# EAGLE design kitting_board (EAGLE 8.2.1)
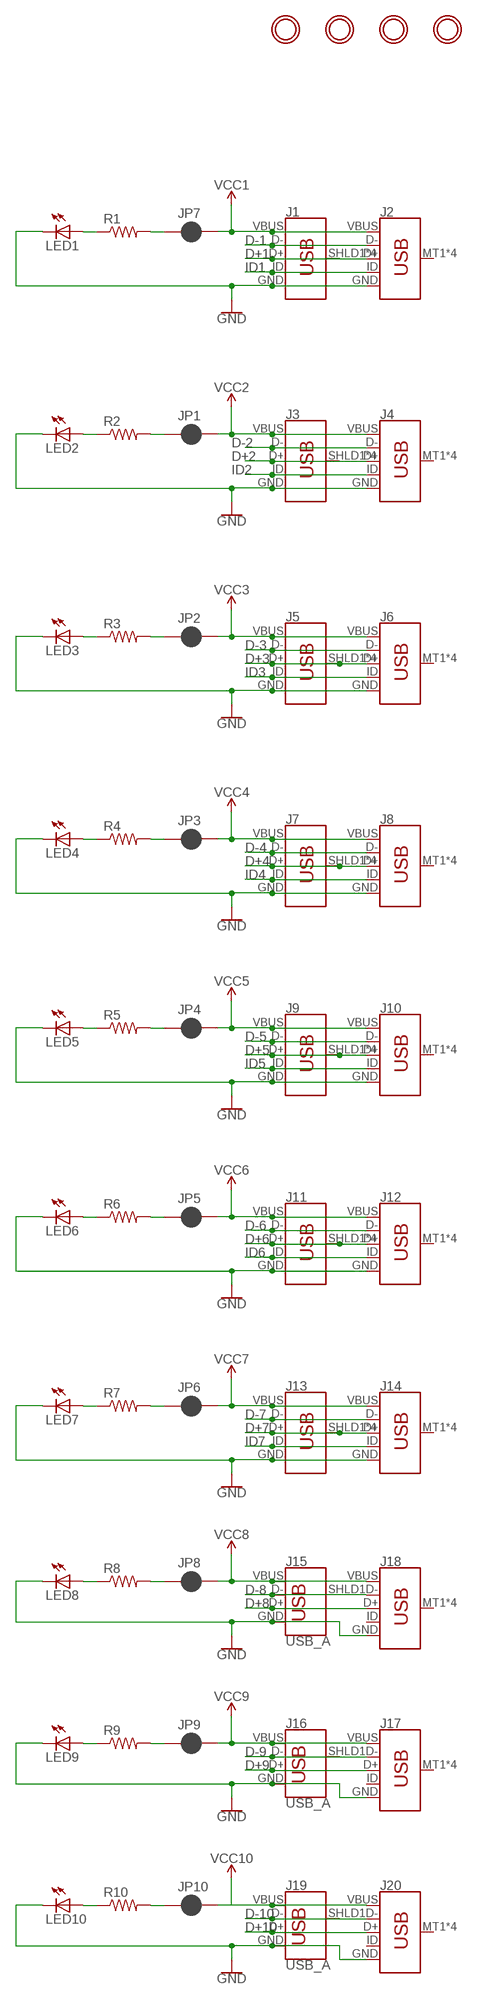
[diagram p0: schematic, sheet 1]

## Parts
J1  USB_MICRO-B_MALE-VERT  [USB_MICROB_VERTICAL]
J2  USB_MICRO-B_SMT  [USB-MICROB]
J3  USB_MICRO-B_MALE-VERT  [USB_MICROB_VERTICAL]
J4  USB_MICRO-B_SMT  [USB-MICROB]
J5  USB_MICRO-B_MALE-VERT  [USB_MICROB_VERTICAL]
J6  USB_MICRO-B_SMT  [USB-MICROB]
J7  USB_MICRO-B_MALE-VERT  [USB_MICROB_VERTICAL]
J8  USB_MICRO-B_SMT  [USB-MICROB]
J9  USB_MICRO-B_MALE-VERT  [USB_MICROB_VERTICAL]
J10  USB_MICRO-B_SMT  [USB-MICROB]
J11  USB_MICRO-B_MALE-VERT  [USB_MICROB_VERTICAL]
J12  USB_MICRO-B_SMT  [USB-MICROB]
J13  USB_MICRO-B_MALE-VERT  [USB_MICROB_VERTICAL]
J14  USB_MICRO-B_SMT  [USB-MICROB]
J15  USB_A  [USB-A-H-FEMALE-VRT-PTH]
J16  USB_A  [USB-A-H-FEMALE-VRT-PTH]
J17  USB_MICRO-B_SMT  [USB-MICROB]
J18  USB_MICRO-B_SMT  [USB-MICROB]
J19  USB_A  [USB-A-H-FEMALE-VRT-PTH]
J20  USB_MICRO-B_SMT  [USB-MICROB]
JP1  JUMPER-SMT_2_NC_PASTE_SILK  [SMT-JUMPER_2_NC_PASTE_SILK]
JP2  JUMPER-SMT_2_NC_PASTE_SILK  [SMT-JUMPER_2_NC_PASTE_SILK]
JP3  JUMPER-SMT_2_NC_PASTE_SILK  [SMT-JUMPER_2_NC_PASTE_SILK]
JP4  JUMPER-SMT_2_NC_PASTE_SILK  [SMT-JUMPER_2_NC_PASTE_SILK]
JP5  JUMPER-SMT_2_NC_PASTE_SILK  [SMT-JUMPER_2_NC_PASTE_SILK]
JP6  JUMPER-SMT_2_NC_PASTE_SILK  [SMT-JUMPER_2_NC_PASTE_SILK]
JP7  JUMPER-SMT_2_NC_PASTE_SILK  [SMT-JUMPER_2_NC_PASTE_SILK]
JP8  JUMPER-SMT_2_NC_PASTE_SILK  [SMT-JUMPER_2_NC_PASTE_SILK]
JP9  JUMPER-SMT_2_NC_PASTE_SILK  [SMT-JUMPER_2_NC_PASTE_SILK]
JP10  JUMPER-SMT_2_NC_PASTE_SILK  [SMT-JUMPER_2_NC_PASTE_SILK]
LED1  LEDCHIPLED_0805  [CHIPLED_0805]
LED2  LEDCHIPLED_0805  [CHIPLED_0805]
LED3  LEDCHIPLED_0805  [CHIPLED_0805]
LED4  LEDCHIPLED_0805  [CHIPLED_0805]
LED5  LEDCHIPLED_0805  [CHIPLED_0805]
LED6  LEDCHIPLED_0805  [CHIPLED_0805]
LED7  LEDCHIPLED_0805  [CHIPLED_0805]
LED8  LEDCHIPLED_0805  [CHIPLED_0805]
LED9  LEDCHIPLED_0805  [CHIPLED_0805]
LED10  LEDCHIPLED_0805  [CHIPLED_0805]
R1  R-US_R0805  [R0805]
R2  R-US_R0805  [R0805]
R3  R-US_R0805  [R0805]
R4  R-US_R0805  [R0805]
R5  R-US_R0805  [R0805]
R6  R-US_R0805  [R0805]
R7  R-US_R0805  [R0805]
R8  R-US_R0805  [R0805]
R9  R-US_R0805  [R0805]
R10  R-US_R0805  [R0805]
U$1  MOUNTINGHOLE3.0THIN  [MOUNTINGHOLE_3.0_PLATEDTHIN]
U$2  MOUNTINGHOLE3.0THIN  [MOUNTINGHOLE_3.0_PLATEDTHIN]
U$3  MOUNTINGHOLE3.0THIN  [MOUNTINGHOLE_3.0_PLATEDTHIN]
U$4  MOUNTINGHOLE3.0THIN  [MOUNTINGHOLE_3.0_PLATEDTHIN]

## Nets
D+1: J1.D+ J2.D+
D+2: J3.D+ J4.D+
D+3: J5.D+ J5.SHLD1(SHIELD) J5.SHLD2(SHIELD) J5.SHLD3(SHIELD) J5.SHLD4(SHIELD) J6.D+
D+4: J7.D+ J7.SHLD1(SHIELD) J7.SHLD2(SHIELD) J7.SHLD3(SHIELD) J7.SHLD4(SHIELD) J8.D+
D+5: J9.D+ J9.SHLD1(SHIELD) J9.SHLD2(SHIELD) J9.SHLD3(SHIELD) J9.SHLD4(SHIELD) J10.D+
D+6: J11.D+ J11.SHLD1(SHIELD) J11.SHLD2(SHIELD) J11.SHLD3(SHIELD) J11.SHLD4(SHIELD) J12.D+
D+7: J13.D+ J13.SHLD1(SHIELD) J13.SHLD2(SHIELD) J13.SHLD3(SHIELD) J13.SHLD4(SHIELD) J14.D+
D+8: J15.D+ J18.D+
D+9: J16.D+ J17.D+
D+10: J19.D+ J20.D+
D-1: J1.D- J2.D-
D-2: J3.D- J4.D-
D-3: J5.D- J6.D-
D-4: J7.D- J8.D-
D-5: J9.D- J10.D-
D-6: J11.D- J12.D-
D-7: J13.D- J14.D-
D-8: J15.D- J18.D-
D-9: J16.D- J17.D-
D-10: J19.D- J20.D-
GND: J1.GND J2.GND J3.GND J4.GND J5.GND J6.GND J7.GND J8.GND J9.GND J10.GND J11.GND J12.GND J13.GND J14.GND J15.GND J16.GND J17.GND J18.GND J19.GND J20.GND LED1.C LED2.C LED3.C LED4.C LED5.C LED6.C LED7.C LED8.C LED9.C LED10.C
ID1: J1.ID J2.ID
ID2: J3.ID J4.ID
ID3: J5.ID J6.ID
ID4: J7.ID J8.ID
ID5: J9.ID J10.ID
ID6: J11.ID J12.ID
ID7: J13.ID J14.ID
N$1: LED2.A R2.1
N$2: JP1.1 R2.2
N$3: LED3.A R3.1
N$4: JP2.1 R3.2
N$5: LED4.A R4.1
N$6: LED1.A R1.1
N$7: JP7.1 R1.2
N$8: JP3.1 R4.2
N$9: LED5.A R5.1
N$10: JP4.1 R5.2
N$11: LED6.A R6.1
N$12: JP5.1 R6.2
N$13: LED7.A R7.1
N$14: JP6.1 R7.2
N$15: LED8.A R8.1
N$16: JP8.1 R8.2
N$17: LED9.A R9.1
N$18: JP9.1 R9.2
N$19: LED10.A R10.1
N$20: JP10.1 R10.2
VCC1: J1.VBUS J2.VBUS JP7.2
VCC2: J3.VBUS J4.VBUS JP1.2
VCC3: J5.VBUS J6.VBUS JP2.2
VCC4: J7.VBUS J8.VBUS JP3.2
VCC5: J9.VBUS J10.VBUS JP4.2
VCC6: J11.VBUS J12.VBUS JP5.2
VCC7: J13.VBUS J14.VBUS JP6.2
VCC8: J15.VBUS J18.VBUS JP8.2
VCC9: J16.VBUS J17.VBUS JP9.2
VCC10: J19.VBUS J20.VBUS JP10.2
Unconnected: J1.SHLD1(SHIELD) J1.SHLD2(SHIELD) J1.SHLD3(SHIELD) J1.SHLD4(SHIELD) J2.MT1(SHIELD) J2.MT2(SHIELD) J2.P$1(SHIELD) J2.P$2(SHIELD) J3.SHLD1(SHIELD) J3.SHLD2(SHIELD) J3.SHLD3(SHIELD) J3.SHLD4(SHIELD) J4.MT1(SHIELD) J4.MT2(SHIELD) J4.P$1(SHIELD) J4.P$2(SHIELD) J6.MT1(SHIELD) J6.MT2(SHIELD) J6.P$1(SHIELD) J6.P$2(SHIELD) J8.MT1(SHIELD) J8.MT2(SHIELD) J8.P$1(SHIELD) J8.P$2(SHIELD) J10.MT1(SHIELD) J10.MT2(SHIELD) J10.P$1(SHIELD) J10.P$2(SHIELD) J12.MT1(SHIELD) J12.MT2(SHIELD) J12.P$1(SHIELD) J12.P$2(SHIELD) J14.MT1(SHIELD) J14.MT2(SHIELD) J14.P$1(SHIELD) J14.P$2(SHIELD) J15.SHLD1(SHIELD) J16.SHLD1(SHIELD) J17.ID J17.MT1(SHIELD) J17.MT2(SHIELD) J17.P$1(SHIELD) J17.P$2(SHIELD) J18.ID J18.MT1(SHIELD) J18.MT2(SHIELD) J18.P$1(SHIELD) J18.P$2(SHIELD) J19.SHLD1(SHIELD) J20.ID J20.MT1(SHIELD) J20.MT2(SHIELD) J20.P$1(SHIELD) J20.P$2(SHIELD)

## Library data of the parts
J1 J3 J5 J7 J9 J11 J13 = SparkFun-Connectors:USB_MICRO-B: USB Type Micro-B Connector Male/female and PTH/SMT variants SparkFun Products: SparkFun microB USB Breakout <https://www.sparkfun.com/products/12035> SparkFun USB microB Plug Breakout <https://www.sparkfun.com/products/10031> SparkFun ESP8266 Thing <https://www.sparkfun.com/products/13231>; PROD_ID: CONN-09900
J2 J4 J6 J8 J10 J12 J14 J17 J18 J20 = SparkFun-Connectors:USB_MICRO-B: USB Type Micro-B Connector Male/female and PTH/SMT variants SparkFun Products: SparkFun microB USB Breakout <https://www.sparkfun.com/products/12035> SparkFun USB microB Plug Breakout <https://www.sparkfun.com/products/10031> SparkFun ESP8266 Thing <https://www.sparkfun.com/products/13231>; PROD_ID: CONN-09505; SF_ID: PRT-08533
J15 J16 J19 = USB_A_female_VRT:USB_A: USB-A Connector Male and female variants, as well as PTH and SMT variants SparkFun Products: SparkFun XBee Explorer Dongle <https://www.sparkfun.com/products/11697> PTH Male SparkFun MicroView-USB Programmer <https://www.sparkfun.com/products/12924> SMT Male SparkFun USB Type A Female Breakout <https://www.sparkfun.com/products/12700> SMT Female
JP1-JP10 = SparkFun-Jumpers:JUMPER-SMT_2_NC_PASTE: Normally closed solder jumper This jumper has an aperture in the stencil to allow solder paste to bridge the split in the wire so it's normally closed (NC). Wick off the solder to open the connection. Reapply solder to reclose the connection.
LED1-LED10 = adafruit:LED: LED OSRAM: - CHIPLED LG R971, LG N971, LY N971, LG Q971, LY Q971, LO R971, LY R971 LH N974, LH R974 LS Q976, LO Q976, LY Q976 LO Q996 - Hyper CHIPLED LW Q18S LB Q993, LB Q99A, LB R99A - SideLED LS A670, LO A670, LY A670, LG A670, LP A670 LB A673, LV A673, LT A673, LW A673 LH A674 LY A675 LS A676, LA A676, LO A676, LY A676, LW A676 LS A679, LY A679, LG A679 - Hyper Micro SIDELED® LS Y876, LA Y876, LO Y876, LY Y876 LT Y87S - SmartLED LW L88C, LW L88S LB L89C, LB L89S, LG L890 LS L89K, LO L89K, LY L89K LS L896, LA L896, LO L896, LY L896 - TOPLED LS T670, LO T670, LY T670, LG T670, LP T670 LSG T670, LSP T670, LSY T670, LOP T670, LYG T670 LG T671, LOG T671, LSG T671 LB T673, LV T673, LT T673, LW T673 LH T674 LS T676, LA T676, LO T676, LY T676, LB T676, LH T676, LSB T676, LW T676 LB T67C, LV T67C, LT T67C, LS T67K, LO T67K, LY T67K, LW E67C LS E67B, LA E67B, LO E67B, LY E67B, LB E67C, LV E67C, LT E67C LW T67C LS T679, LY T679, LG T679 LS T770, LO T770, LY T770, LG T770, LP T770 LB T773, LV T773, LT T773, LW T773 LH T774 LS E675, LA E675, LY E675, LS T675 LS T776, LA T776, LO T776, LY T776, LB T776 LHGB T686 LT T68C, LB T68C - Hyper Mini TOPLED® LB M676 - Mini TOPLED Santana® LG M470 LS M47K, LO M47K, LY M47K Source: http://www.osram.convergy.de/
R1-R10 = adafruit:R-US_: RESISTOR, American symbol
U$1-U$4 = ADS1x15:MOUNTINGHOLE: Mounting Hole For #2 screws (0.086"/2.18mm width, 0.094"/2.4mm hole) use 2.5mm

## Board
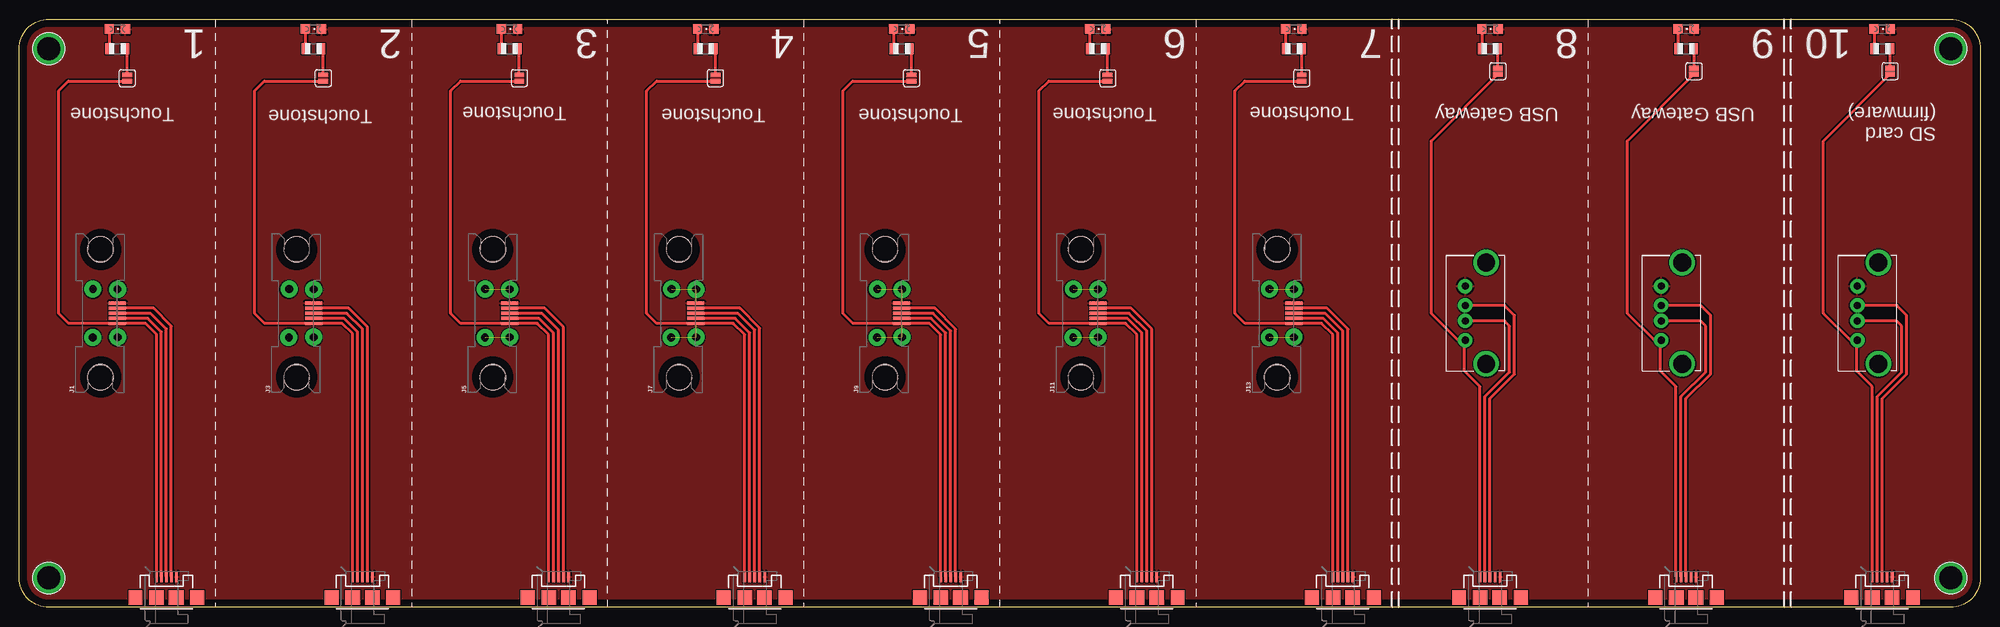
[diagram p1: board, top side]
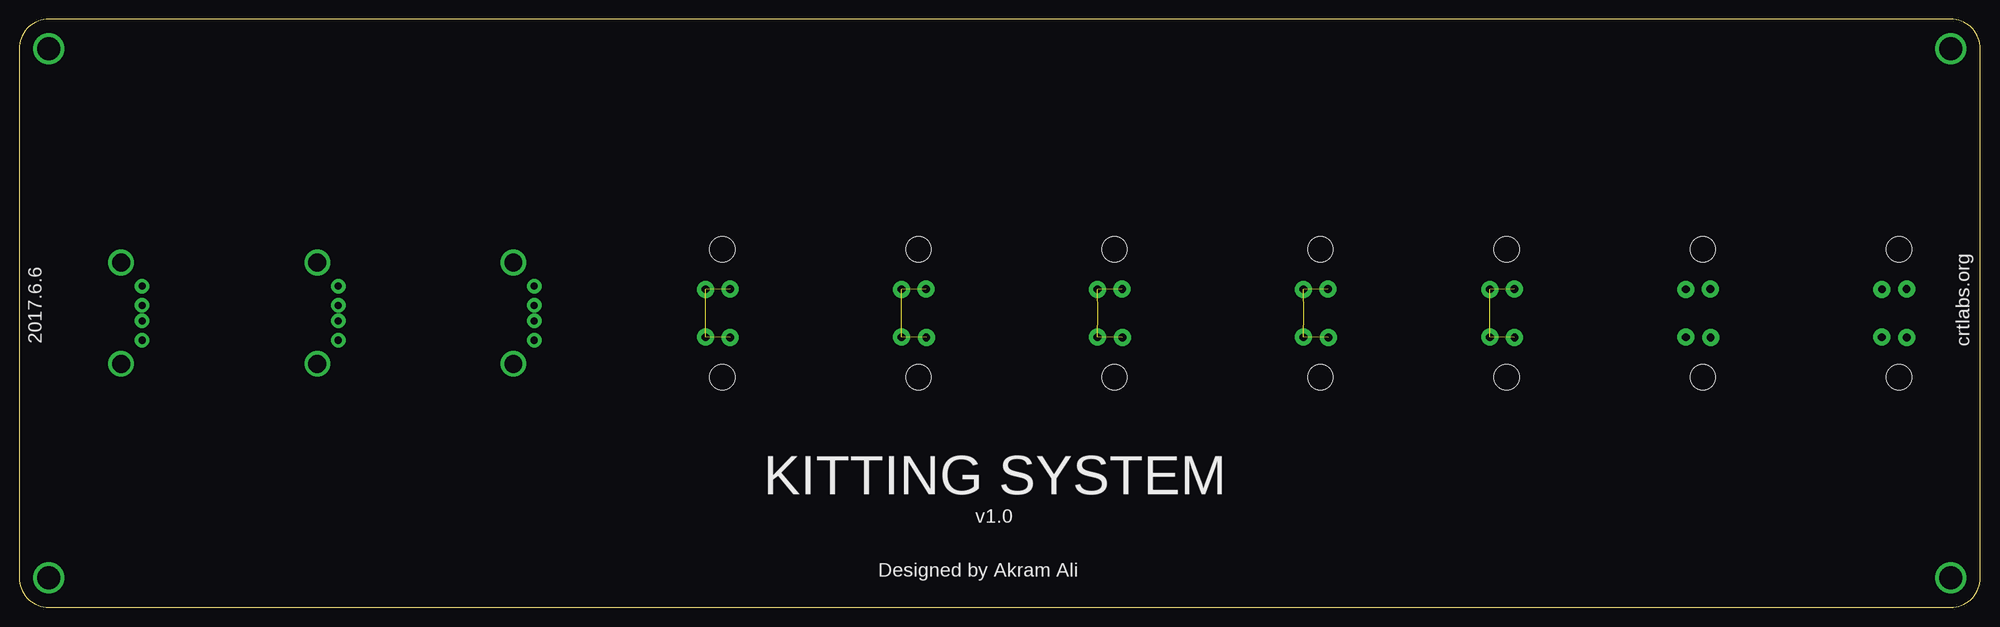
[diagram p2: board, bottom side, seen from below]

Size 254 x 76.2 mm. Coordinates in mm from the lower left corner, seen from the top.
Outline: 0,3.81 0,72.39 arc-90 3.81,76.2 250.19,76.2 arc-90 254,72.39 254,3.81 arc-90 250.19,0 3.81,0 arc-90 0,3.81
Copper layers (1*16): Top 0.035mm / dielectric 1.5mm / Bottom 0.035mm
Design rules "default": minimum track width 6mil, minimum drill 0.35mm, track to track 6mil, track to pad 6mil, pad to pad 6mil, via to via 6mil, smd to smd 6mil, copper to edge 40mil, drill to drill 6mil, minimum pad ring 10mil, minimum via ring 8mil, stop-mask expansion 4mil, vias tented up to drill 0mil, thermal gap 10mil

### Footprints (pad centres in the part's own frame; a part is rotated, then mirrored left to right if it is on the bottom)
USB_MICROB_VERTICAL = smd 0.4 x 2.2: D+ 0,0; D- -0.65,0; GND 1.3,0; ID 0.65,0; VBUS -1.3,0 | drill 1.016 pad 2.2: SHLD1 -3.121,3.183; SHLD2 3.122,3.16; SHLD3 -3.098,-0.027; SHLD4 3.108,-0.026 | hole 3.3: -8.275,2.17; 8.275,2.17
USB-MICROB = smd 1.4 x 0.35: D+ -2.65,0; D- -2.65,-0.65; GND -2.65,1.3; ID -2.65,0.65; VBUS -2.65,-1.3 | smd 1.9 x 1.8: MT1 0,-4; MT2 0,4 | smd 1.9 x 1.9: P$1 0,-1.27; P$2 0,1.27
USB-A-H-FEMALE-VRT-PTH = drill 0.92 pad 1.88: D+ 8.5,5.11; D- 6.5,5.11; GND 11,5.11; VBUS 4,5.11 | drill 2.3: SHLD1 0.93,2.4; SHLD2 14.07,2.4
SMT-JUMPER_2_NC_PASTE_SILK = smd 0.635 x 1.27: 1 -0.406,0; 2 0.406,0
CHIPLED_0805 = smd 1.2 x 1.2: A 0,-1.05; C 0,1.05
R0805 = smd 1.1 x 1.4: 1 -1,0; 2 1,0
MOUNTINGHOLE_3.0_PLATEDTHIN = drill 3 pad 3.6: P$1 0,0

### Placement (x,y rotation side)
J1  12.7,38.1 90 top
J2  19.05,1.27 270 top
J3  38.1,38.1 90 top
J4  44.45,1.27 270 top
J5  63.5,38.1 90 top
J6  69.85,1.27 270 top
J7  87.63,38.1 90 top
J8  95.25,1.27 270 top
J9  114.3,38.1 90 top
J10  120.65,1.27 270 top
J11  139.7,38.1 90 top
J12  146.05,1.27 270 top
J13  165.1,38.1 90 top
J14  171.45,1.27 270 top
J15  192.41,30.61 90 top
J16  217.81,30.61 90 top
J17  215.9,1.27 270 top
J18  190.5,1.27 270 top
J19  243.21,30.61 90 top
J20  241.3,1.27 270 top
JP1  39.37,68.58 270 top
JP2  64.77,68.58 270 top
JP3  90.17,68.58 270 top
JP4  115.57,68.58 270 top
JP5  140.97,68.58 270 top
JP6  166.12,68.58 270 top
JP7  13.97,68.58 270 top
JP8  191.52,69.47 270 top
JP9  216.92,69.47 270 top
JP10  242.32,69.47 270 top
LED1  12.7,74.93 270 top
LED2  38.1,74.93 270 top
LED3  63.5,74.93 270 top
LED4  88.9,74.93 270 top
LED5  114.3,74.93 270 top
LED6  139.7,74.93 270 top
LED7  165.1,74.93 270 top
LED8  190.5,74.93 270 top
LED9  215.9,74.93 270 top
LED10  241.3,74.93 270 top
R1  12.7,72.39 0 top
R2  38.1,72.39 0 top
R3  63.5,72.39 0 top
R4  88.9,72.39 0 top
R5  114.3,72.39 0 top
R6  139.7,72.39 0 top
R7  165.1,72.39 0 top
R8  190.5,72.39 0 top
R9  215.9,72.39 0 top
R10  241.3,72.39 0 top
U$1  3.81,3.81 0 top
U$2  3.81,72.39 0 top
U$3  250.19,72.39 0 top
U$4  250.19,3.81 0 top

### Tracks (layer width: path | path; a pad name or v marks a point on that pad's centre or on a via)
D+1
  Top 0.381: J1.D+ 17.02,38.1 19.05,36.07 J2.D+
D+2
  Top 0.381: J3.D+ 42.42,38.1 44.45,36.07 J4.D+
D+3  (4 unrouted)
  Top 0.381: J5.D+ 67.69,38.1 69.85,35.94 J6.D+
D+4  (4 unrouted)
  Top 0.381: J7.D+ 93.09,38.1 95.25,35.94 J8.D+
D+5  (4 unrouted)
  Top 0.381: J9.D+ 118.36,38.1 120.65,35.81 J10.D+
D+6  (4 unrouted)
  Top 0.381: J11.D+ 143.76,38.1 146.05,35.81 J12.D+
D+7  (4 unrouted)
  Top 0.381: J13.D+ 169.16,38.1 171.45,35.81 J14.D+
D+8
  Top 0.381: J18.D+ 190.5,27.05 193.68,30.23 193.68,37.83 192.4,39.11 | 192.4,39.11 J15.D+ | 192.4,39.11 192.41,39.12
D+9
  Top 0.381: J17.D+ 215.9,27.05 219.07,30.23 219.07,37.83 217.8,39.11 | 217.8,39.11 J16.D+ | 217.8,39.11 217.81,39.12
D+10
  Top 0.381: 243.2,39.11 J19.D+ | 243.2,39.11 243.21,39.12 | J20.D+ 241.3,27.05 244.47,30.23 244.47,37.83 243.2,39.11
D-1
  Top 0.381: J1.D- 16.65,37.45 18.4,35.7 J2.D-
D-2
  Top 0.381: J3.D- 42.05,37.45 43.8,35.7 J4.D-
D-3
  Top 0.381: J5.D- 67.33,37.45 69.2,35.58 J6.D-
D-4
  Top 0.381: J7.D- 92.72,37.45 94.6,35.58 J8.D-
D-5
  Top 0.381: J9.D- 118.12,37.45 120,35.58 J10.D-
D-6
  Top 0.381: J11.D- 143.53,37.45 145.4,35.58 J12.D-
D-7
  Top 0.381: J13.D- 168.93,37.45 170.8,35.58 J14.D-
D-8
  Top 0.381: J18.D- 189.85,27.29 193.04,30.48 193.04,36.45 192.38,37.11 | 192.38,37.11 J15.D- | 192.38,37.11 192.41,37.08
D-9
  Top 0.381: 217.78,37.11 J16.D- | 217.78,37.11 217.81,37.08 | J17.D- 215.25,27.29 218.44,30.48 218.44,36.45 217.78,37.11
D-10
  Top 0.381: J20.D- 240.65,27.29 243.84,30.48 243.84,36.45 243.18,37.11 | 243.18,37.11 J19.D- | 243.18,37.11 243.21,37.08
GND
  pour Top: 0,0 0,76.2 254,76.2 254,0
ID1
  Top 0.381: J1.ID 17.38,38.75 19.7,36.43 J2.ID
ID2
  Top 0.381: J3.ID 42.66,38.75 45.1,36.31 J4.ID
ID3
  Top 0.381: J5.ID 68.06,38.75 70.5,36.31 J6.ID
ID4
  Top 0.381: J7.ID 93.33,38.75 95.9,36.18 J8.ID
ID5
  Top 0.381: J9.ID 118.6,38.75 121.3,36.05 J10.ID
ID6
  Top 0.381: J11.ID 144,38.75 146.7,36.05 J12.ID
ID7
  Top 0.381: J13.ID 169.4,38.75 172.1,36.05 J14.ID
N$1
  Top 0.381: R2.1 37.1,74.88 LED2.A
N$2
  Top 0.381: JP1.1 39.37,72.12 R2.2
N$3
  Top 0.381: R3.1 62.5,74.88 LED3.A
N$4
  Top 0.381: JP2.1 64.77,72.12 R3.2
N$5
  Top 0.381: R4.1 87.9,74.88 LED4.A
N$6
  Top 0.381: R1.1 11.7,74.88 LED1.A
N$7
  Top 0.381: JP7.1 13.97,72.12 R1.2
N$8
  Top 0.381: JP3.1 90.17,72.12 R4.2
N$9
  Top 0.381: R5.1 113.3,74.88 LED5.A
N$10
  Top 0.381: JP4.1 115.57,72.12 R5.2
N$11
  Top 0.381: R6.1 138.7,74.88 LED6.A
N$12
  Top 0.381: JP5.1 140.97,72.12 R6.2
N$13
  Top 0.381: R7.1 164.1,74.88 LED7.A
N$14
  Top 0.381: JP6.1 166.12,72.37 R7.2
N$15
  Top 0.381: R8.1 189.5,74.88 LED8.A
N$16
  Top 0.381: JP8.1 191.52,72.37 R8.2
N$17
  Top 0.381: LED9.A 214.85,72.44 R9.1
N$18
  Top 0.381: R9.2 216.9,69.89 JP9.1
N$19
  Top 0.381: LED10.A 240.25,72.44 R10.1
N$20
  Top 0.381: R10.2 242.3,69.89 JP10.1
VCC1
  Top 0.381: J2.VBUS 17.75,35.4 16.35,36.8 J1.VBUS 6.38,36.8 5.08,38.1 5.08,66.93 6.35,68.2 13.95,68.2 JP7.2
VCC2
  Top 0.381: J4.VBUS 43.15,35.46 41.81,36.8 J3.VBUS 31.78,36.8 30.48,38.1 30.48,66.93 31.75,68.2 39.34,68.2 JP1.2
VCC3
  Top 0.381: 67.09,36.8 J5.VBUS 57.18,36.8 55.88,38.1 55.88,66.93 57.15,68.2 64.75,68.2 JP2.2 | 67.09,36.8 67.18,36.7 | J6.VBUS 68.55,35.34 67.09,36.8
VCC4
  Top 0.381: 92.49,36.8 J7.VBUS 82.58,36.8 81.28,38.1 81.28,66.93 82.55,68.2 90.14,68.2 JP3.2 | 92.49,36.8 92.58,36.7 | J8.VBUS 93.95,35.34 92.49,36.8
VCC5
  Top 0.381: 117.89,36.8 J9.VBUS 107.98,36.8 106.68,38.1 106.68,66.93 107.95,68.2 115.55,68.2 JP4.2 | 117.89,36.8 117.98,36.7 | J10.VBUS 119.35,35.34 117.89,36.8
VCC6
  Top 0.381: 143.29,36.8 J11.VBUS 133.38,36.8 132.08,38.1 132.08,66.93 133.35,68.2 140.94,68.2 JP5.2 | 143.29,36.8 143.38,36.7 | J12.VBUS 144.75,35.34 143.29,36.8
VCC7
  Top 0.381: J14.VBUS 170.15,35.34 168.69,36.8 J13.VBUS 158.78,36.8 157.48,38.1 157.48,66.93 158.75,68.2 166.09,68.2 JP6.2
VCC8
  Top 0.381: J18.VBUS 189.2,28.61 187.2,30.61 187.2,34.51 J15.VBUS 186.37,34.61 182.88,38.1 182.88,60.43 JP8.2
VCC9
  Top 0.381: J17.VBUS 214.6,28.61 212.6,30.61 212.6,34.51 J16.VBUS 211.77,34.61 208.28,38.1 208.28,60.43 JP9.2
VCC10
  Top 0.381: J20.VBUS 240,28.61 238,30.61 238,34.51 J19.VBUS 237.17,34.61 233.68,38.1 233.68,60.43 JP10.2

### Text on the board
tPlace: 1 | 2 | 3 | 4 | 5 | 6 | 7 | 8 | 9 | 10 | Touchstone | Touchstone | Touchstone | Touchstone | Touchstone | Touchstone | Touchstone | USB Gateway | USB Gateway | SD card / (firmware)
bPlace: crtlabs.org | 2017.6.6 | KITTING SYSTEM | v1.0 | Designed by Akram Ali